# EAGLE design ScrollingTextDisplay (EAGLE 7.6.0)
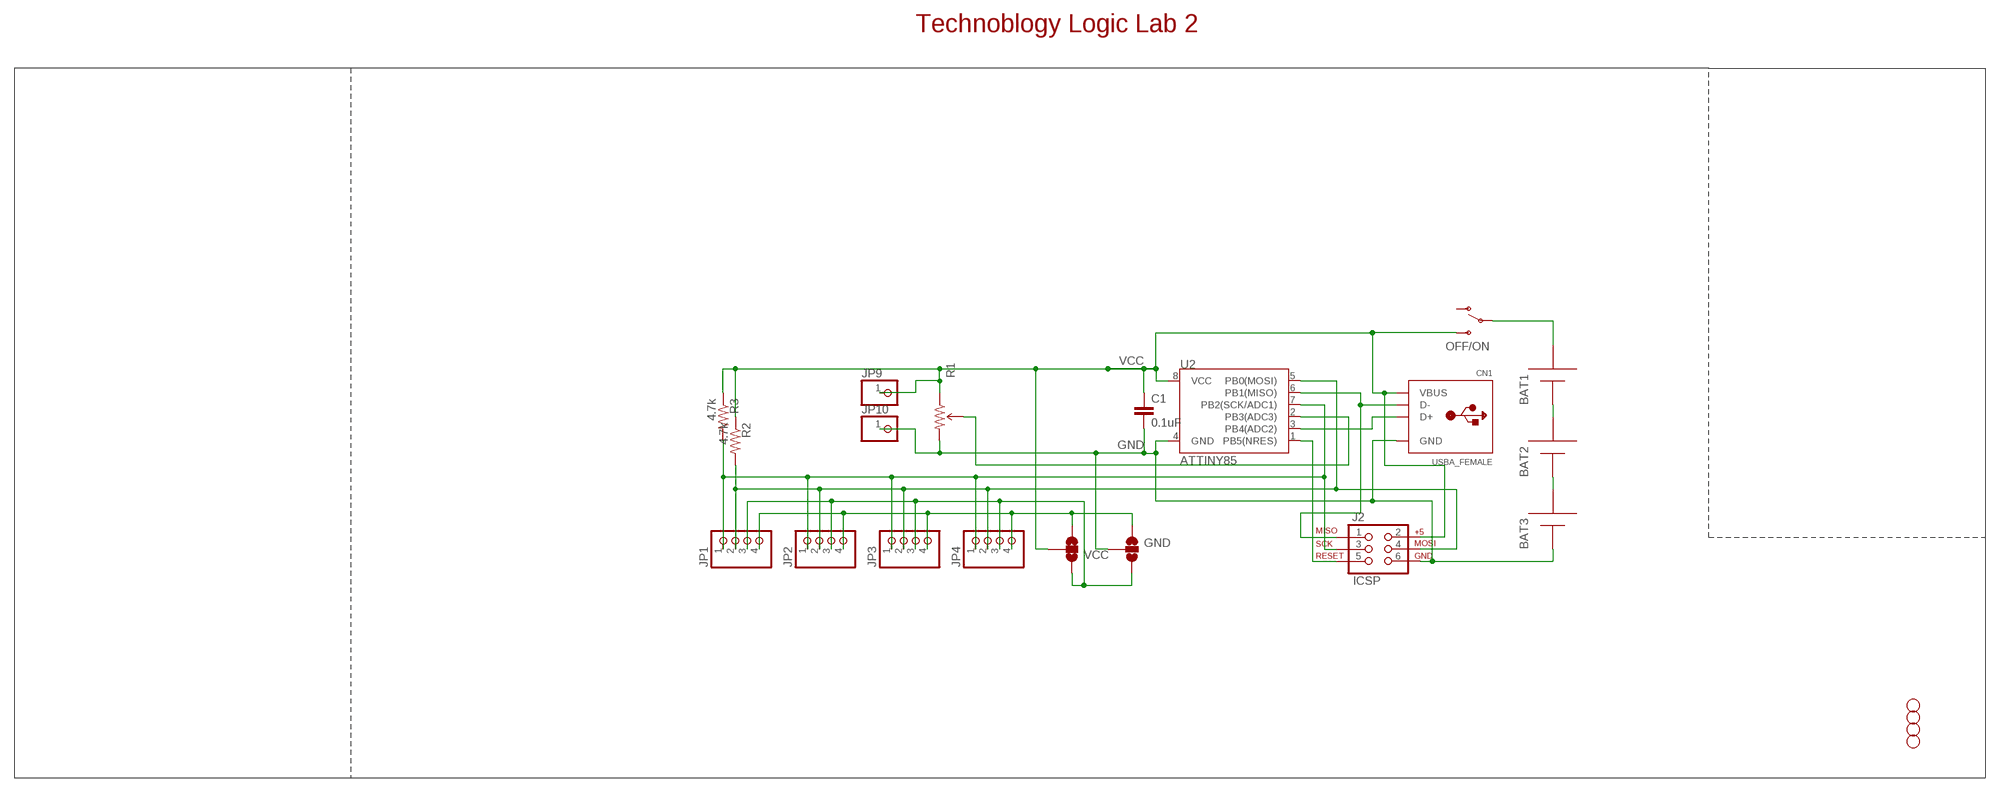
[diagram p0: schematic, sheet 1]

## Parts
BAT1  AAA  [12BH412]
BAT2  AAA  [12BH412]
BAT3  AAA  [12BH412]
C1  0.1uF  0.1UF-50V-20%(PTH)KIT-EZ  [CAP-PTH-SMALL-KIT]
CN1  USBA_FEMALE  USB_TYPEAPTHFML  [USB_HOST-PTH]
GND  JUMPER-PAD-3-NOFULL_BOX_SILK  [PAD-JUMPER-3-NO_YES_SILK_FULL_BOX]
J2  ICSP  AVR_SPI_PRG_6PTH  [2X3]
JP1  HEADER-1X4ROUND  [1X04_ROUND]
JP2  HEADER-1X4ROUND  [1X04_ROUND]
JP3  HEADER-1X4ROUND  [1X04_ROUND]
JP4  HEADER-1X4ROUND  [1X04_ROUND]
JP5  STAND-OFF  [STAND-OFF]
JP6  STAND-OFF  [STAND-OFF]
JP7  STAND-OFF  [STAND-OFF]
JP8  STAND-OFF  [STAND-OFF]
JP9  HEADER-1X1ROUND  [1X01_ROUND]
JP10  HEADER-1X1ROUND  [1X01_ROUND]
OFF/ON  SWITCH-SPDTKIT  [SWITCH-SPDT_KIT]
R1  TRIMPOTPTH  [TRIM_POT_PTH]
R2  4.7k  RESISTORAXIAL-0.3  [AXIAL-0.3]
R3  4.7k  RESISTORAXIAL-0.3  [AXIAL-0.3]
U2  ATTINY85  ATTINY45TINY85-20-DIP  [DIP08]
VCC  JUMPER-PAD-3-NOFULL_BOX_SILK  [PAD-JUMPER-3-NO_YES_SILK_FULL_BOX]

## Nets
END: GND.1 JP1.4 JP2.4 JP3.4 JP4.4 VCC.3
GND: BAT3.- C1.2 CN1.GND GND.2 J2.6 JP10.1 R1.3(CW) U2.4(GND)
MID: GND.3 JP1.3 JP2.3 JP3.3 JP4.3 VCC.1
N$1: R1.2(WIPER) U2.2(PB3(ADC3))
N$7: BAT1.+ OFF/ON.2(P)
N$8: BAT1.- BAT2.+
N$9: BAT2.- BAT3.+
N$10: J2.4 JP1.2 JP2.2 JP3.2 JP4.2 R2.P$2 U2.5(PB0(MOSI))
N$11: J2.3 JP1.1 JP2.1 JP3.1 JP4.1 R3.P$2 U2.7(PB2(SCK/ADC1))
N$12: CN1.D- J2.1 U2.6(PB1(MISO))
N$13: CN1.D+ U2.3(PB4(ADC2))
N$14: J2.5 U2.1(PB5(NRES))
VCC: C1.1 CN1.VBUS J2.2 JP9.1 OFF/ON.3(S) R1.1(CCW) R2.P$1 R3.P$1 U2.8(VCC) VCC.2
Unconnected: OFF/ON.1(O)

## Notes on the sheet
- Technoblogy Logic Lab 2

## Library data of the parts
BAT1-BAT3 = adafruit:AAA: AAA PC pin holder Mouser part #12BH412 - but pretty much any 1x AAA battery holder should be the same http://www.ladyada.net/library/pcb/eaglelibrary.html
C1 = SparkFun-Capacitors:0.1UF-50V-20%(PTH): CAP-08370; PROD_ID: CAP-08370
CN1 = microbuilder:USB_TYPEA: USB - Type A Connectors Male types stick out and are inserted into a PC or matching females parts (these are the connectors used on USB Memory Sticks, etc.). Female parts are generally used for USB Host and accept a male-type connector. SMT - 4UCON: 10017 PTHFML - Digikey: 609-1045-ND, 4UCon: 05241 PCB - Use 2.0mm thick PCBs with this footprint
GND VCC = SparkFun-Passives:JUMPER-PAD-3-NO
J2 = SparkFun:AVR_SPI_PRG_6: AVR ISP 6 Pin This is the reduced ISP connector for AVR programming. Common on Arduino. This footprint will take up less PCB space and can be used with a 10-pin to 6-pin adapter such as SKU: BOB-08508
JP1-JP4 = microbuilder:HEADER-1X4: PIN HEADER
JP5-JP8 = SparkFun:STAND-OFF: Stand Off This is the mechanical footprint for a #4 phillips button head screw. Use the keepout ring to avoid running the screw head into surrounding components. SKU : PRT-00447
JP9 JP10 = microbuilder:HEADER-1X1: PIN HEADER
OFF/ON = technoblogy:SWITCH-SPDT: SPDT Switch Simple slide switch, Spark Fun Electronics SKU : COM-00102 DPDT SMT slide switch, AYZ0202, SWCH-08179; PROD_ID: SWCH-08261
R1 = SparkFun-Electromechanical:TRIMPOT: Various small potentiometers for "set-and-forget" applications
R2 R3 = SparkFun-Passives:RESISTOR: Resistor Basic schematic elements and footprints for 0603, 1206, and PTH resistors.
U2 = SparkFun-DigitalIC:ATTINY45: Atmel 8-pin 2/4/8kB flash uC; PROD_ID: IC-09445; VALUE: TINY85-20-DIP

## Board
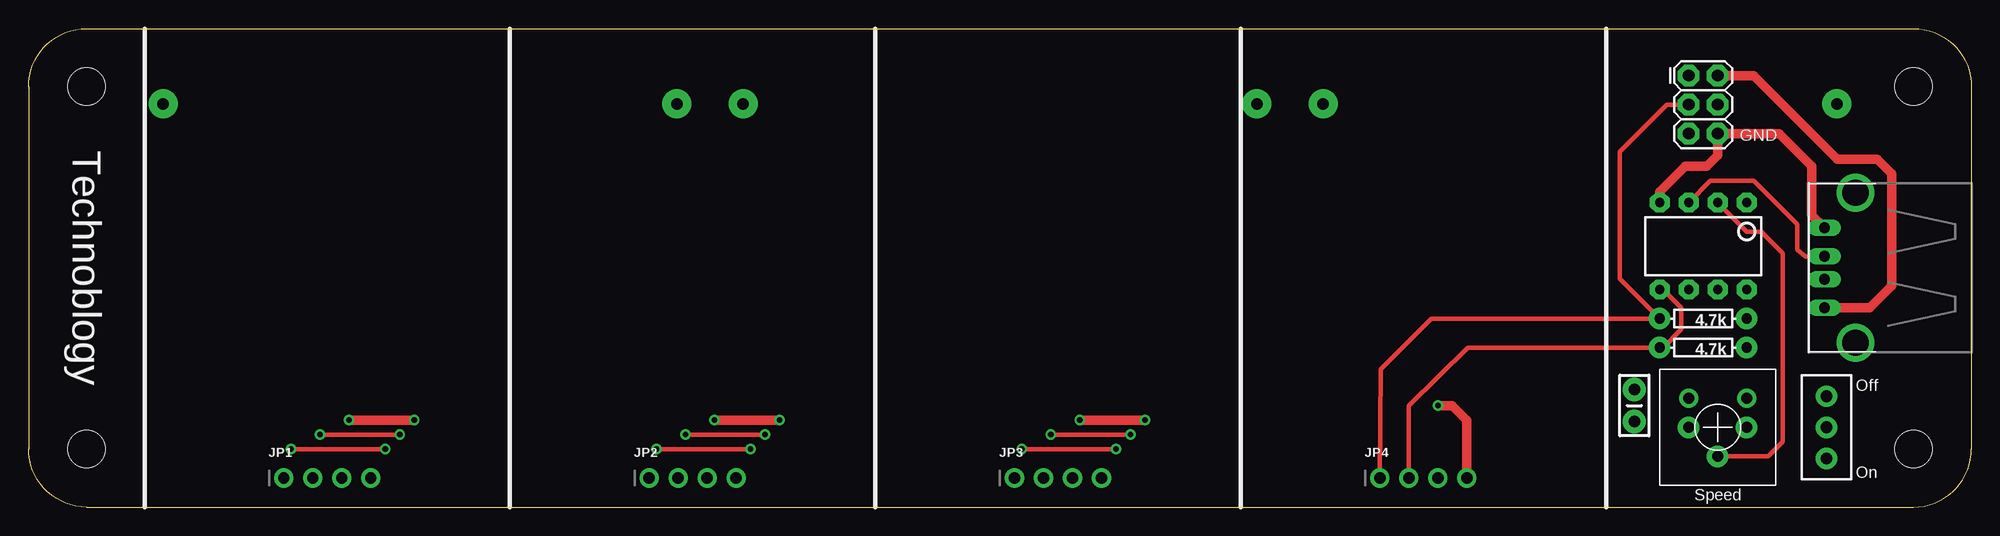
[diagram p1: board, top side]
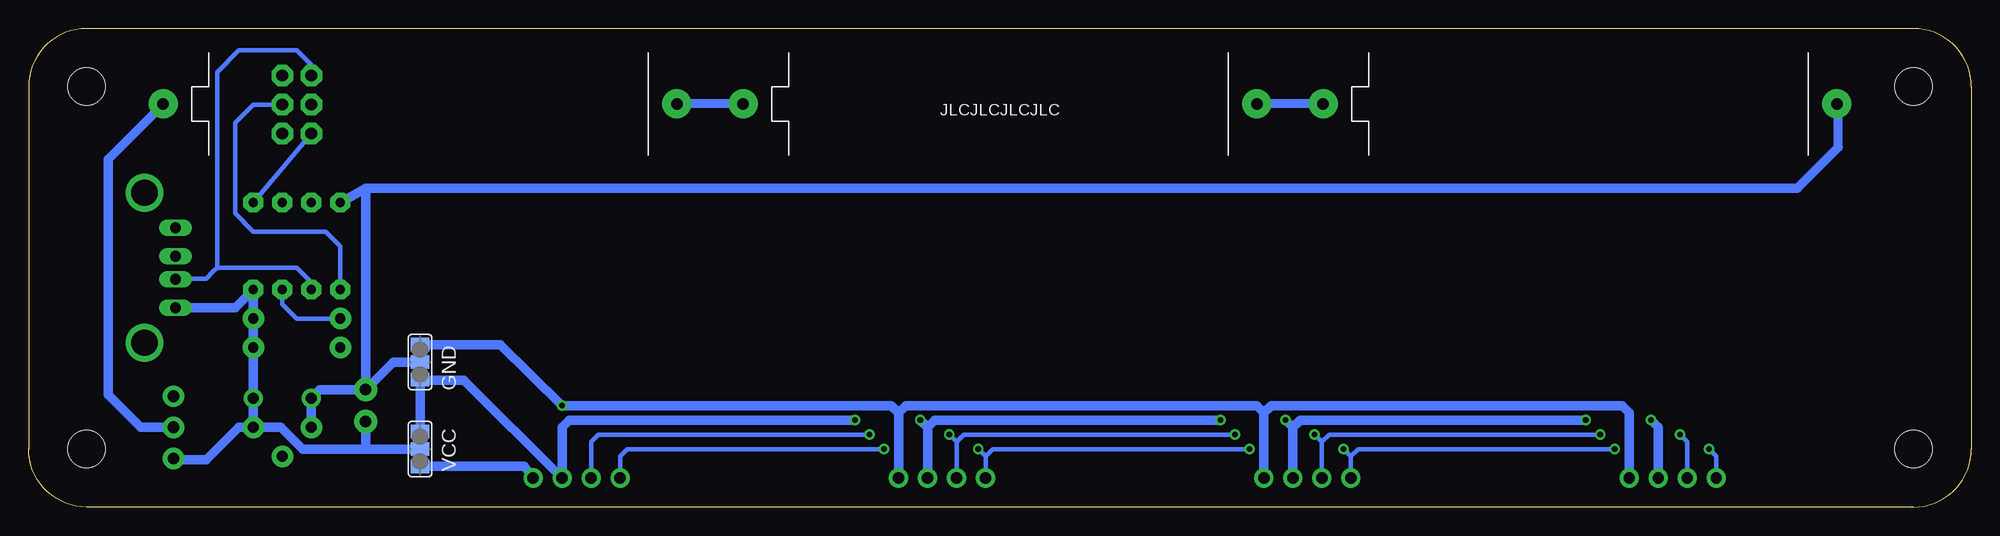
[diagram p2: board, bottom side, seen from below]

Size 170.18 x 41.91 mm. Coordinates in mm from the lower left corner, seen from the top.
Outline: 5.08,0 165.1,0 arc90 170.18,5.08 170.18,36.83 arc90 165.1,41.91 5.08,41.91 arc90 0,36.83 0,5.08 arc90 5.08,0
Copper layers (1*16): Top 0.035mm / dielectric 1.5mm / Bottom 0.035mm
Design rules "default *": minimum track width 10mil, minimum drill 24mil, track to track 8mil, track to pad 8mil, pad to pad 8mil, via to via 8mil, smd to smd 8mil, copper to edge 40mil, drill to drill 8mil, minimum pad ring 10mil, minimum via ring 8mil, stop-mask expansion 4mil, vias tented up to drill 20mil, thermal gap 10mil

### Footprints (pad centres in the part's own frame; a part is rotated, then mirrored left to right if it is on the bottom)
12BH412 = drill 1 pad 2.54: + 22.5,0; - -22.5,0
CAP-PTH-SMALL-KIT = drill 1.016 pad 2.032: 1 -1.397,0; 2 1.397,0
USB_HOST-PTH = drill 0.95 long: D+ 1,6.52; D- -1,6.52; GND 3.5,6.52; VBUS -3.5,6.52 | drill 2.3 pad 2.9: S1 -6.57,3.81; S2 6.57,3.81
PAD-JUMPER-3-NO_YES_SILK_FULL_BOX = smd 1.168 x 1.6: 1 -1.524,0; 2 0,0; 3 1.524,0
2X3 = drill 1.016 pad 1.88 octagon: 1 0,0; 2 0,2.54; 3 2.54,0; 4 2.54,2.54; 5 5.08,0; 6 5.08,2.54
1X04_ROUND = drill 1 pad 1.676: 1 -3.81,0; 2 -1.27,0; 3 1.27,0; 4 3.81,0
STAND-OFF = hole 3.302: 0,0
1X01_ROUND = drill 1 pad 1.676: 1 0,0
SWITCH-SPDT_KIT = drill 1.016 pad 1.88: 1 0,2.718; 2 0,0; 3 0,-2.718
TRIM_POT_PTH = drill 1 pad 1.88: 1 -2.54,-2.54; 2 0,0; 3 2.54,-2.54
AXIAL-0.3 = drill 0.9 pad 1.88: P$1 -3.81,0; P$2 3.81,0
DIP08 = drill 0.813 pad 1.727 octagon: 1 -3.81,-3.81; 2 -1.27,-3.81; 3 1.27,-3.81; 4 3.81,-3.81; 5 3.81,3.81; 6 1.27,3.81; 7 -1.27,3.81; 8 -3.81,3.81

### Placement (x,y rotation side)
BAT1  135.89,35.31 180 bottom
BAT2  85.09,35.31 180 bottom
BAT3  34.29,35.31 180 bottom
C1  140.65,8.89 90 top
CN1  163.83,20.95 90 top
GND  135.89,12.7 270 bottom
J2  145.41,37.78 270 top
JP1  26.16,2.54 0 top
JP2  58.17,2.54 0 top
JP3  90.17,2.54 0 top
JP4  122.17,2.54 0 top
JP5  5.08,5.08 0 top
JP6  5.08,36.83 0 top
JP7  165.1,36.83 0 top
JP8  165.1,5.08 0 top
JP9  150.5,9.53 0 top
JP10  145.41,9.53 0 top
OFF/ON  157.48,6.99 0 top
R1  147.95,4.45 180 top
R2  146.69,13.97 180 top
R3  146.69,16.51 180 top
U2  146.69,22.86 180 top
VCC  135.89,5.08 270 bottom

### Tracks (layer width: path | path; a pad name or v marks a point on that pad's centre or on a via)
END  (via drill 0.5)
  Top 0.813: v123.44,8.89 124.71,8.89 125.98,7.62 JP4.4
  Bottom 0.813: 93.98,8.26 94.61,8.89 v123.44,8.89 128.84,14.22 GND.1 | 61.98,8.26 61.34,8.89 30.61,8.89 29.97,8.26 JP1.4 | 93.98,8.26 93.34,8.89 62.61,8.89 61.98,8.26 | JP3.4 93.98,8.26 | JP2.4 61.98,8.26 | VCC.3 126.75,3.56 JP4.4
GND
  Top 0.813: J2.6 148.59,32.7 | 148.59,32.7 153.35,32.7 156.21,29.84 156.21,25.58 CN1.GND | U2.4 142.88,27.62 145.1,29.84 147,29.84 147.95,30.8 147.95,32.07 148.59,32.7
  Bottom 0.787: 11.68,31.5 11.68,35.2 BAT3.-
  Bottom 0.813: U2.4 140.65,27.94 | 140.65,27.94 C1.2 | R1.3 JP10.1 144.65,10.29 C1.2 | 11.68,31.5 15.24,27.94 140.65,27.94 | C1.2 140.65,12.7 | GND.2 138.24,12.7 C1.2
MID  (via drill 0.5)
  Top 0.813: v28.07,7.62 v33.78,7.62 | v60.07,7.62 v65.79,7.62 | v92.07,7.62 v97.79,7.62
  Bottom 0.813: v92.07,7.62 91.44,6.99 | JP3.3 91.44,6.99 | 91.44,6.99 90.8,7.62 v65.79,7.62 | v60.07,7.62 59.44,6.99 | JP2.3 59.44,6.99 | 59.44,6.99 58.8,7.62 v33.78,7.62 | v97.79,7.62 122.81,7.62 123.44,6.99 JP4.3 132.08,11.11 135.83,11.11 GND.3 VCC.1 | v28.07,7.62 27.43,6.99 JP1.3
N$1
  Top 0.406: U2.2 150.5,24.13 151.76,24.13 153.67,22.23 153.67,5.71 152.4,4.45 R1.2
N$7
  Bottom 0.813: BAT1.+ 158.39,35.28 163.19,30.48 163.19,9.84 160.34,6.99 OFF/ON.2
N$8
  Bottom 0.787: BAT2.+ BAT1.-
N$9
  Bottom 0.787: BAT3.+ BAT2.-
N$10  (via drill 0.5)
  Top 0.406: v25.53,6.35 v32.51,6.35 | v57.53,6.35 v64.52,6.35 | v89.53,6.35 v96.52,6.35 | JP4.2 120.9,8.89 126.05,13.97 R2.P$2 143.19,13.97 144.78,15.56 144.78,17.46 143.19,19.05 U2.5
  Bottom 0.406: JP1.2 24.89,5.71 v25.53,6.35 | 56.9,5.71 56.26,6.35 v32.51,6.35 | 56.9,5.71 JP2.2 | JP3.2 88.9,5.71 | 88.9,5.71 88.27,6.35 v64.52,6.35 | v57.53,6.35 56.9,5.71 | v89.53,6.35 88.9,5.71 | v96.52,6.35 120.27,6.35 120.9,5.71 JP4.2 | J2.4 150.5,35.24 152.08,33.66 152.08,25.72 150.5,24.13 144.14,24.13 142.88,22.86 U2.5
N$11  (via drill 0.5)
  Top 0.406: v22.99,5.08 v31.24,5.08 | v54.99,5.08 v63.25,5.08 | v86.99,5.08 v95.25,5.08 | JP4.1 118.43,12.06 122.87,16.51 R3.P$2 139.38,20 139.38,31.11 143.51,35.24 J2.3
  Bottom 0.406: JP1.1 22.35,4.45 v22.99,5.08 | JP2.1 54.36,4.45 | 54.36,4.45 v54.99,5.08 | 86.36,4.45 85.72,5.08 v63.25,5.08 | 86.36,4.45 JP3.1 | 54.36,4.45 53.72,5.08 v31.24,5.08 | v86.99,5.08 86.36,4.45 | v95.25,5.08 117.73,5.08 118.36,4.45 JP4.1 | U2.7 147.95,17.78 146.69,16.51 R3.P$2
N$12
  Bottom 0.406: J2.1 145.41,38.73 146.69,40.01 151.76,40.01 153.67,38.1 153.67,20.95 | CN1.D- 157.26,20 154.62,20 153.99,20.64 153.67,20.95 | U2.6 145.41,19.68 146.69,20.95 153.67,20.95
N$13
  Top 0.406: U2.3 147.32,28.57 151.13,28.57 154.94,24.77 154.94,22.54 155.67,21.91 CN1.D+
N$14
  Bottom 0.406: J2.5 U2.1
VCC
  Top 0.406: 157.32,17.46 CN1.VBUS
  Top 0.813: J2.2 151.13,37.78 158.43,30.48 161.92,30.48 163.19,29.21 163.19,19.37 161.29,17.46 157.32,17.46
  Bottom 0.406: 150.82,13.64 R2.P$1
  Bottom 0.813: R1.1 JP9.1 R2.P$1 R3.P$1 U2.8 152.09,17.45 CN1.VBUS | R1.1 148.08,6.99 146.18,5.08 140.65,5.08 | VCC.2 140.65,5.08 | C1.1 140.65,5.08 | R1.1 151.76,6.99 154.62,4.13 156.98,4.13 OFF/ON.3

### Text on the board
tPlace: GND | Technoblogy | Off | On | Speed
bPlace: JLCJLCJLCJLC